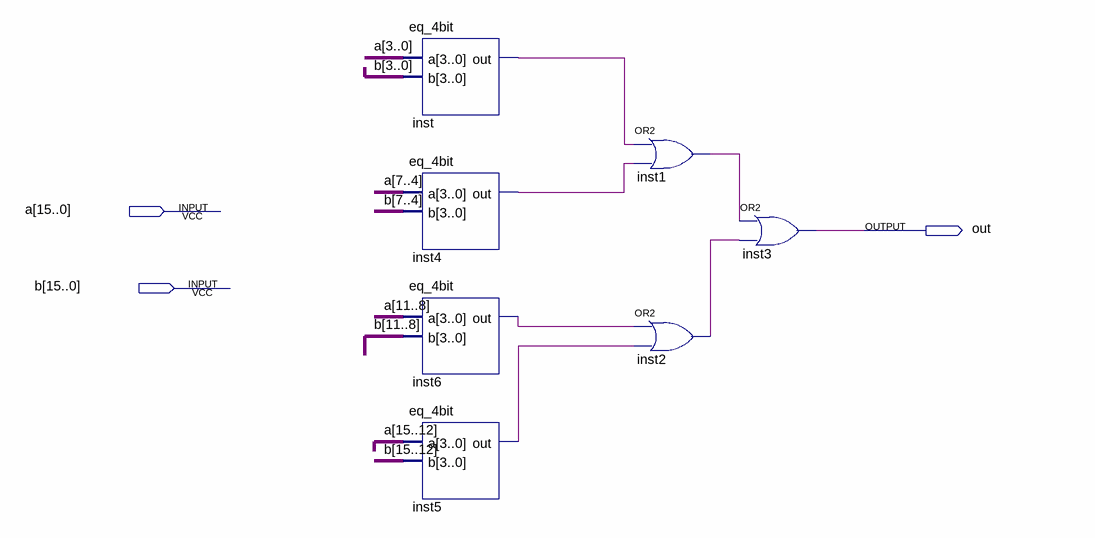
[diagram p0: schematic sheet]
// Quartus schematic eq_16bit.bdf as structural Verilog: 7 symbols, 3 pins
module eq_16bit (
  input  [15:0] a,
  input  [15:0] b,
  output out
);

  wire inst1_out, inst2_out, inst4_out, inst5_out, inst6_out, inst_out;

  eq_4bit inst (.a(a[3:0]), .b(b[3:0]), .out(inst_out));
  eq_4bit inst4 (.a(a[7:4]), .b(b[7:4]), .out(inst4_out));
  eq_4bit inst6 (.a(a[11:8]), .b(b[11:8]), .out(inst6_out));
  eq_4bit inst5 (.a(a[15:12]), .b(b[15:12]), .out(inst5_out));
  or inst1 (inst1_out, inst_out, inst4_out);
  or inst2 (inst2_out, inst6_out, inst5_out);
  or inst3 (out, inst1_out, inst2_out);
endmodule
